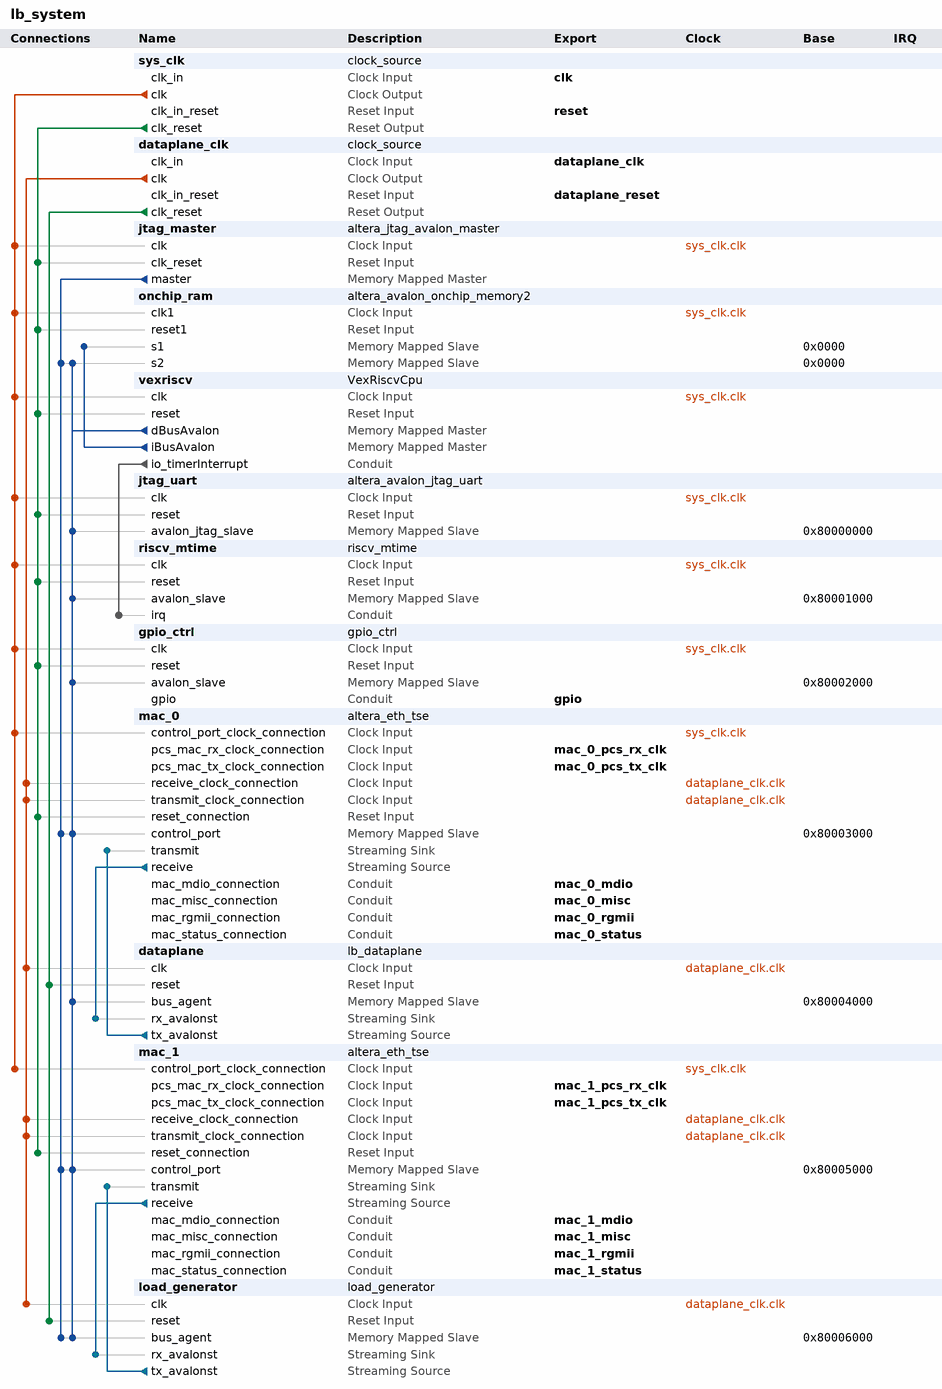
[diagram p0: system contents]
# Platform Designer (Qsys) system lb_system, Cyclone IV E EP4CE115F29C7
# Parameters at their usual value, and those the tool derives, are not listed.
package require -exact qsys 20.1
create_system lb_system
set_project_property DEVICE_FAMILY {Cyclone IV E}
set_project_property DEVICE EP4CE115F29C7

add_instance sys_clk clock_source 20.1
set_instance_parameter_value sys_clk clockFrequency 50000000

add_instance dataplane_clk clock_source 20.1
set_instance_parameter_value dataplane_clk clockFrequency 100000000

add_instance jtag_master altera_jtag_avalon_master 20.1

add_instance onchip_ram altera_avalon_onchip_memory2 20.1
set_instance_parameter_value onchip_ram dataWidth 32
set_instance_parameter_value onchip_ram dualPort true
set_instance_parameter_value onchip_ram initMemContent true
set_instance_parameter_value onchip_ram initializationFileName ../../sw/build/fpga_lb.mif
set_instance_parameter_value onchip_ram memorySize 65536
set_instance_parameter_value onchip_ram resetrequest_enabled false
set_instance_parameter_value onchip_ram singleClockOperation true
set_instance_parameter_value onchip_ram slave1Latency 2
set_instance_parameter_value onchip_ram slave2Latency 2
set_instance_parameter_value onchip_ram useNonDefaultInitFile true

add_instance vexriscv VexRiscvCpu 1.0

add_instance jtag_uart altera_avalon_jtag_uart 20.1
set_instance_parameter_value jtag_uart simInteractiveOptions NO_INTERACTIVE_WINDOWS

add_instance riscv_mtime riscv_mtime 1.0

add_instance gpio_ctrl gpio_ctrl 1.0

add_instance mac_0 altera_eth_tse 20.1
set_instance_parameter_value mac_0 XCVR_RCFG_JTAG_ENABLE 0
set_instance_parameter_value mac_0 XCVR_SET_CAPABILITY_REG_ENABLE 0
set_instance_parameter_value mac_0 XCVR_SET_CSR_SOFT_LOGIC_ENABLE 0
set_instance_parameter_value mac_0 XCVR_SET_PRBS_SOFT_LOGIC_ENABLE 0
set_instance_parameter_value mac_0 XCVR_SET_USER_IDENTIFIER 0
set_instance_parameter_value mac_0 core_variation SMALL_MAC_GIGE
set_instance_parameter_value mac_0 enable_hd_logic false
set_instance_parameter_value mac_0 enable_mac_flow_ctrl false
set_instance_parameter_value mac_0 enable_magic_detect false
set_instance_parameter_value mac_0 enable_shift16 false
set_instance_parameter_value mac_0 ifGMII RGMII
set_instance_parameter_value mac_0 ing_addr 11
set_instance_parameter_value mac_0 mdio_clk_div 40
set_instance_parameter_value mac_0 stat_cnt_ena false
set_instance_parameter_value mac_0 transceiver_type NONE

add_instance dataplane lb_dataplane 1.0

add_instance mac_1 altera_eth_tse 20.1
set_instance_parameter_value mac_1 XCVR_RCFG_JTAG_ENABLE 0
set_instance_parameter_value mac_1 XCVR_SET_CAPABILITY_REG_ENABLE 0
set_instance_parameter_value mac_1 XCVR_SET_CSR_SOFT_LOGIC_ENABLE 0
set_instance_parameter_value mac_1 XCVR_SET_PRBS_SOFT_LOGIC_ENABLE 0
set_instance_parameter_value mac_1 XCVR_SET_USER_IDENTIFIER 0
set_instance_parameter_value mac_1 core_variation SMALL_MAC_GIGE
set_instance_parameter_value mac_1 enable_hd_logic false
set_instance_parameter_value mac_1 enable_mac_flow_ctrl false
set_instance_parameter_value mac_1 enable_magic_detect false
set_instance_parameter_value mac_1 enable_shift16 false
set_instance_parameter_value mac_1 ifGMII RGMII
set_instance_parameter_value mac_1 ing_addr 11
set_instance_parameter_value mac_1 mdio_clk_div 40
set_instance_parameter_value mac_1 stat_cnt_ena false
set_instance_parameter_value mac_1 transceiver_type NONE

add_instance load_generator load_generator 1.0

# connections
add_connection dataplane_clk.clk dataplane.clk clock
add_connection dataplane_clk.clk load_generator.clk clock
add_connection dataplane_clk.clk mac_0.receive_clock_connection clock
add_connection dataplane_clk.clk mac_0.transmit_clock_connection clock
add_connection dataplane_clk.clk mac_1.receive_clock_connection clock
add_connection dataplane_clk.clk mac_1.transmit_clock_connection clock
add_connection sys_clk.clk gpio_ctrl.clk clock
add_connection sys_clk.clk jtag_master.clk clock
add_connection sys_clk.clk jtag_uart.clk clock
add_connection sys_clk.clk mac_0.control_port_clock_connection clock
add_connection sys_clk.clk mac_1.control_port_clock_connection clock
add_connection sys_clk.clk onchip_ram.clk1 clock
add_connection sys_clk.clk riscv_mtime.clk clock
add_connection sys_clk.clk vexriscv.clk clock
add_connection dataplane_clk.clk_reset dataplane.reset reset
add_connection dataplane_clk.clk_reset load_generator.reset reset
add_connection sys_clk.clk_reset gpio_ctrl.reset reset
add_connection sys_clk.clk_reset jtag_master.clk_reset reset
add_connection sys_clk.clk_reset jtag_uart.reset reset
add_connection sys_clk.clk_reset mac_0.reset_connection reset
add_connection sys_clk.clk_reset mac_1.reset_connection reset
add_connection sys_clk.clk_reset onchip_ram.reset1 reset
add_connection sys_clk.clk_reset riscv_mtime.reset reset
add_connection sys_clk.clk_reset vexriscv.reset reset
add_connection jtag_master.master load_generator.bus_agent avalon
set_connection_parameter_value jtag_master.master/load_generator.bus_agent baseAddress 0x80006000
add_connection jtag_master.master mac_0.control_port avalon
set_connection_parameter_value jtag_master.master/mac_0.control_port baseAddress 0x80003000
add_connection jtag_master.master mac_1.control_port avalon
set_connection_parameter_value jtag_master.master/mac_1.control_port baseAddress 0x80005000
add_connection jtag_master.master onchip_ram.s2 avalon
set_connection_parameter_value jtag_master.master/onchip_ram.s2 baseAddress 0x0000
add_connection vexriscv.dBusAvalon dataplane.bus_agent avalon
set_connection_parameter_value vexriscv.dBusAvalon/dataplane.bus_agent baseAddress 0x80004000
add_connection vexriscv.dBusAvalon gpio_ctrl.avalon_slave avalon
set_connection_parameter_value vexriscv.dBusAvalon/gpio_ctrl.avalon_slave baseAddress 0x80002000
add_connection vexriscv.dBusAvalon jtag_uart.avalon_jtag_slave avalon
set_connection_parameter_value vexriscv.dBusAvalon/jtag_uart.avalon_jtag_slave baseAddress 0x80000000
add_connection vexriscv.dBusAvalon load_generator.bus_agent avalon
set_connection_parameter_value vexriscv.dBusAvalon/load_generator.bus_agent baseAddress 0x80006000
add_connection vexriscv.dBusAvalon mac_0.control_port avalon
set_connection_parameter_value vexriscv.dBusAvalon/mac_0.control_port baseAddress 0x80003000
add_connection vexriscv.dBusAvalon mac_1.control_port avalon
set_connection_parameter_value vexriscv.dBusAvalon/mac_1.control_port baseAddress 0x80005000
add_connection vexriscv.dBusAvalon onchip_ram.s2 avalon
set_connection_parameter_value vexriscv.dBusAvalon/onchip_ram.s2 baseAddress 0x0000
add_connection vexriscv.dBusAvalon riscv_mtime.avalon_slave avalon
set_connection_parameter_value vexriscv.dBusAvalon/riscv_mtime.avalon_slave baseAddress 0x80001000
add_connection vexriscv.iBusAvalon onchip_ram.s1 avalon
set_connection_parameter_value vexriscv.iBusAvalon/onchip_ram.s1 baseAddress 0x0000
add_connection dataplane.tx_avalonst mac_0.transmit avalon_streaming
add_connection load_generator.tx_avalonst mac_1.transmit avalon_streaming
add_connection mac_0.receive dataplane.rx_avalonst avalon_streaming
add_connection mac_1.receive load_generator.rx_avalonst avalon_streaming
add_connection vexriscv.io_timerInterrupt riscv_mtime.irq conduit

# exported interfaces
add_interface clk clock sink
set_interface_property clk EXPORT_OF sys_clk.clk_in
add_interface dataplane_clk clock sink
set_interface_property dataplane_clk EXPORT_OF dataplane_clk.clk_in
add_interface dataplane_reset reset sink
set_interface_property dataplane_reset EXPORT_OF dataplane_clk.clk_in_reset
add_interface gpio conduit end
set_interface_property gpio EXPORT_OF gpio_ctrl.gpio
add_interface mac_0_mdio conduit end
set_interface_property mac_0_mdio EXPORT_OF mac_0.mac_mdio_connection
add_interface mac_0_misc conduit end
set_interface_property mac_0_misc EXPORT_OF mac_0.mac_misc_connection
add_interface mac_0_pcs_rx_clk clock sink
set_interface_property mac_0_pcs_rx_clk EXPORT_OF mac_0.pcs_mac_rx_clock_connection
add_interface mac_0_pcs_tx_clk clock sink
set_interface_property mac_0_pcs_tx_clk EXPORT_OF mac_0.pcs_mac_tx_clock_connection
add_interface mac_0_rgmii conduit end
set_interface_property mac_0_rgmii EXPORT_OF mac_0.mac_rgmii_connection
add_interface mac_0_status conduit end
set_interface_property mac_0_status EXPORT_OF mac_0.mac_status_connection
add_interface mac_1_mdio conduit end
set_interface_property mac_1_mdio EXPORT_OF mac_1.mac_mdio_connection
add_interface mac_1_misc conduit end
set_interface_property mac_1_misc EXPORT_OF mac_1.mac_misc_connection
add_interface mac_1_pcs_rx_clk clock sink
set_interface_property mac_1_pcs_rx_clk EXPORT_OF mac_1.pcs_mac_rx_clock_connection
add_interface mac_1_pcs_tx_clk clock sink
set_interface_property mac_1_pcs_tx_clk EXPORT_OF mac_1.pcs_mac_tx_clock_connection
add_interface mac_1_rgmii conduit end
set_interface_property mac_1_rgmii EXPORT_OF mac_1.mac_rgmii_connection
add_interface mac_1_status conduit end
set_interface_property mac_1_status EXPORT_OF mac_1.mac_status_connection
add_interface reset reset sink
set_interface_property reset EXPORT_OF sys_clk.clk_in_reset

set_interconnect_requirement {$system} qsys_mm.clockCrossingAdapter HANDSHAKE
set_interconnect_requirement {$system} qsys_mm.enableEccProtection FALSE
set_interconnect_requirement {$system} qsys_mm.insertDefaultSlave FALSE
set_interconnect_requirement {$system} qsys_mm.maxAdditionalLatency 1

save_system lb_system.qsys
